# Altium schematic sheet EEPROM.SchDoc
size A; SheetNumber: 4; SheetTotal: 12
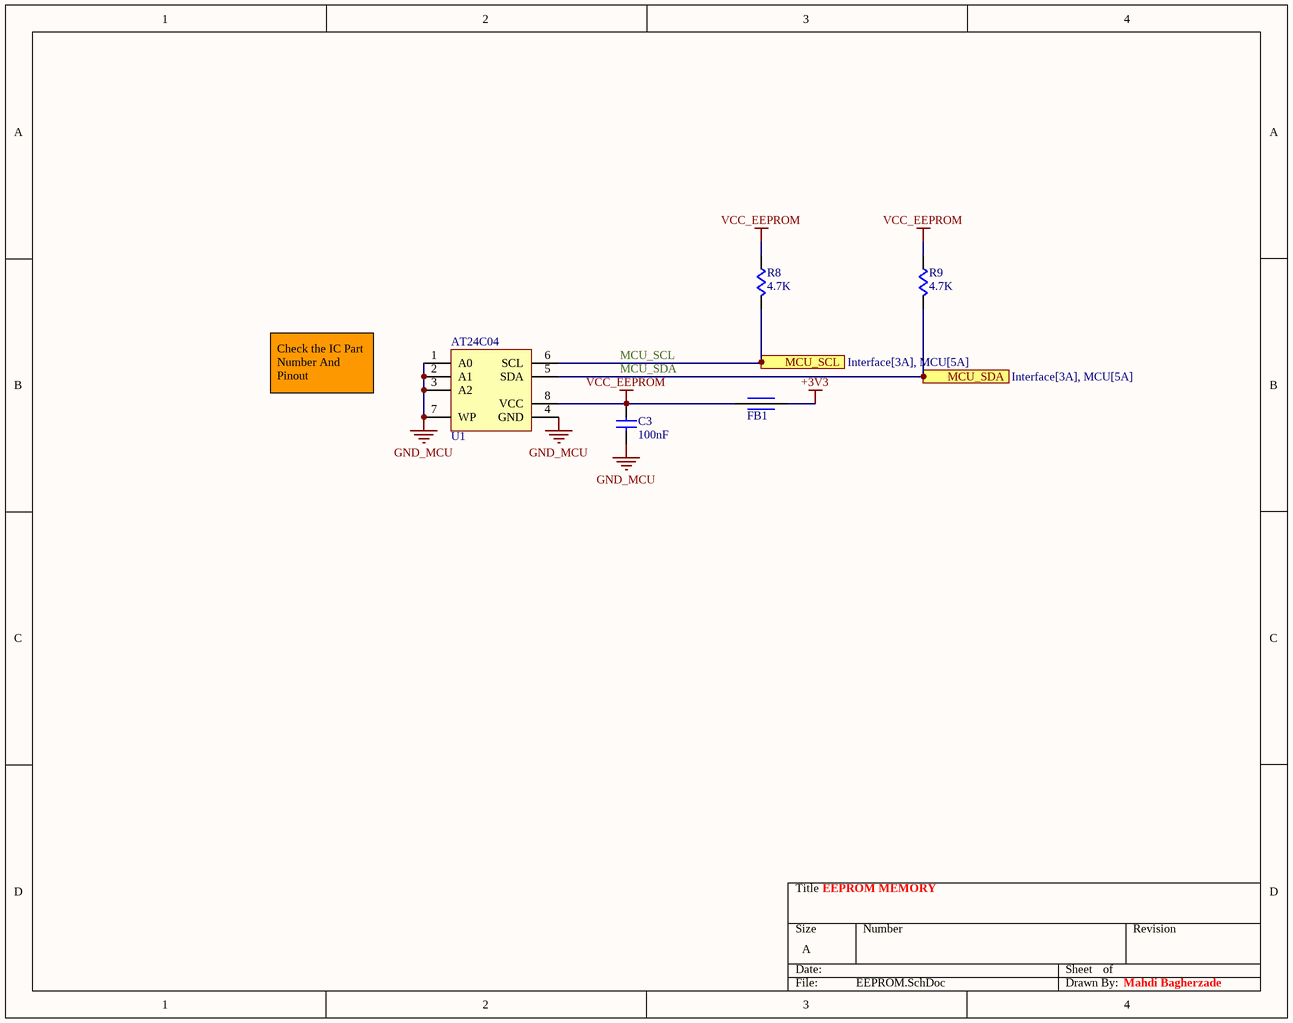
[diagram p0: EEPROM.SchDoc]

## Parts
C3  value 100nF  [C-0805]  (hidden comment: CAP Cer 100nF-50V-X7R-SMD)
FB1  Ferrite Bead SMD  [FB-0805]  (value not drawn)
R8  value 4.7K  [R-0805]  (hidden comment: RES 4.7K-5%-1/8W-SMD)
R9  value 4.7K  [R-0805]  (hidden comment: RES 4.7K-5%-1/8W-SMD)
U1  IC AT24C04-SMD  [SOIC8]  (value not drawn)

## Ports
MCU_SCL (see Interface[3A], MCU[5A]), MCU_SDA (see Interface[3A], MCU[5A])

## Nets
+3V3: FB1.2
GND_MCU: C3.2 U1.1(A0) U1.2(A1) U1.3(A2) U1.4(GND) U1.7(WP)
VCC_EEPROM: C3.1 FB1.1 R8.1 R9.1 U1.8(VCC)
MCU_SCL: R8.2 U1.6(SCL) ; port MCU_SCL
MCU_SDA: R9.2 U1.5(SDA) ; port MCU_SDA

## Notes on the sheet
- Check the IC Part Number And Pinout
- EEPROM MEMORY
- Mahdi Bagherzade

## Library data of the parts
C3 = CAP-CER: CAPACITOR; Phone Number: 0915 8700 314; Voltage: 50V; Tolerance: X7R; Type: SMD; Publisher: Mahdi Bagherzadeh; ComponentLink1Description: Linkedin; ComponentLink1URL: https://ir.linkedin.com/in/mahdi-bagherzade; Published Date: 9-15-2024
FB1 = FERRITE BEAD: INDUCATOR; Phone Number: 0915 8700 314; Publisher: Mahdi Bagherzadeh; ComponentLink1Description: Linkedin; ComponentLink1URL: https://ir.linkedin.com/in/mahdi-bagherzade; Published Date: 9-15-2024; Type: SMD
R8 R9 = RES: RESISTOR; Phone Number: 0915 8700 314; Power: 1/8W; Tolerance: 5%; Publisher: Mahdi Bagherzadeh; ComponentLink1Description: Linkedin; ComponentLink1URL: https://ir.linkedin.com/in/mahdi-bagherzade; Published Date: 9-15-2024; Type: SMD
U1 = AT24C04: IC; Phone Number: 0915 8700 314; Publisher: Mahdi Bagherzadeh; ComponentLink1Description: Linkedin; ComponentLink1URL: https://ir.linkedin.com/in/mahdi-bagherzade; Published Date: 9-15-2024; Code: AT24C04; Type: SMD